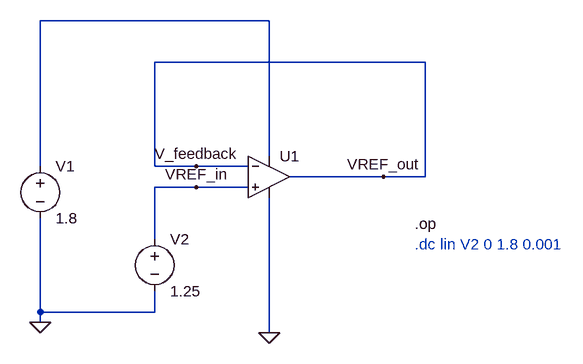
[diagram p0: schematic dc_ideal.asc]
dc_ideal.asc, the LTspice schematic file:
Version 4
SHEET 1 880 680
WIRE 112 -128 -240 -128
WIRE 352 -64 -64 -64
WIRE 112 80 112 -128
WIRE -240 96 -240 -128
WIRE -64 96 -64 -64
WIRE 0 96 -64 96
WIRE 80 96 0 96
WIRE 288 112 144 112
WIRE 352 112 352 -64
WIRE 352 112 288 112
WIRE 0 128 -64 128
WIRE 80 128 0 128
WIRE -64 208 -64 128
WIRE -240 320 -240 176
WIRE -64 320 -64 288
WIRE -64 320 -240 320
WIRE -240 336 -240 320
WIRE 112 352 112 144
FLAG 112 352 0
FLAG -240 336 0
FLAG 0 128 VREF_in
FLAG 288 112 VREF_out
FLAG 0 96 V_feedback
SYMBOL voltage -240 80 R0
WINDOW 123 0 0 Left 0
WINDOW 39 0 0 Left 0
SYMATTR InstName V1
SYMATTR Value 1.8
SYMBOL voltage -64 192 R0
WINDOW 123 0 0 Left 0
WINDOW 39 0 0 Left 0
SYMATTR InstName V2
SYMATTR Value 1.25
SYMBOL OpAmps\\UniversalOpAmp 112 112 R0
SYMATTR InstName U1
TEXT 336 184 Left 2 !.op
TEXT 336 216 Left 2 ;.dc lin V2 0 1.8 0.001

The netlist it stands for:
* dc_ideal.asc
V1 N001 0 1.8
V2 VREF_in 0 1.25
XU1 VREF_in V_feedback N001 0 V_feedback level1 Avol=1Meg GBW=10Meg Vos=0 En=0 Enk=0 In=0 Ink=0 Rin=500Meg  ; pins In+ In- V+ V- OUT
.op
* .dc lin V2 0 1.8 0.001
.lib UniversalOpAmp1.lib
.backanno
.end